# Altium schematic sheet AutoToolZeroProbe.SchDoc
size A4
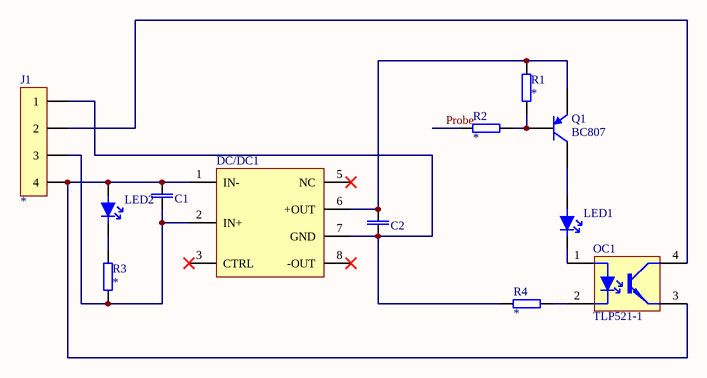
[diagram p0: AutoToolZeroProbe.SchDoc]

## Parts
C1  (no value)  [CAP 0805]
C2  (no value)  [CAP 0805]
DC/DC1  (no value)  [EC2SA]
J1  *  [SIL4]
LED1  (no value)  [LED3G]
LED2  (no value)  [LED3G]
OC1  TLP521-1  [SOP4L]
Q1  BC807  [FP_SOT23-3]
R1  *  [RES 0805]
R2  *  [RES 0805]
R3  *  [RES 0805]
R4  *  [RES 0805]

## Nets
Probe: R2.1
NetC1_1: C1.1 DC/DC1.2(IN+) J1.3 R3.1
NetC1_2: C1.2 DC/DC1.1(IN-) J1.4 LED2.1(A) OC1.3(E)
NetC2_1: C2.1 DC/DC1.7(GND) J1.1 R4.2
NetC2_2: C2.2 DC/DC1.6(+OUT) Q1.1(E) R1.2
NetJ1_2: J1.2 OC1.4(C)
NetLED1_1: LED1.1(A) Q1.3(C)
NetLED1_2: LED1.2(K) OC1.1(A)
NetLED2_2: LED2.2(K) R3.2
NetOC1_2: OC1.2(K) R4.1
NetQ1_2: Q1.2(B) R1.1 R2.2

Not connected (* = marked no-connect by the designer): DC/DC1 3(CTRL)* 5(NC)* 8(-OUT)*

## Library data of the parts
C1 C2 = CAP: NON POLARIZED CAPACITOR
DC/DC1 = EC2SA: 2W DC-DC CONVERTER
J1 = HEADER4: 4 PIN HEADER; Value: *
LED1 LED2 = LED: SMD, 0805 LED
OC1 = TLP521: photocoupler; value: TLP521-1
Q1 = BC807: PNP Transistor; pin to pad: 1>2 2>1; Reference: 1081221; Name: BC807-25  Bipolar (BJT) Single Transistor, PNP, 45 V, 100 MHz; Supplier: Farnell
R1-R4 = RES: RESISTOR; Value: *